# Altium schematic sheet Control.SchDoc
size A
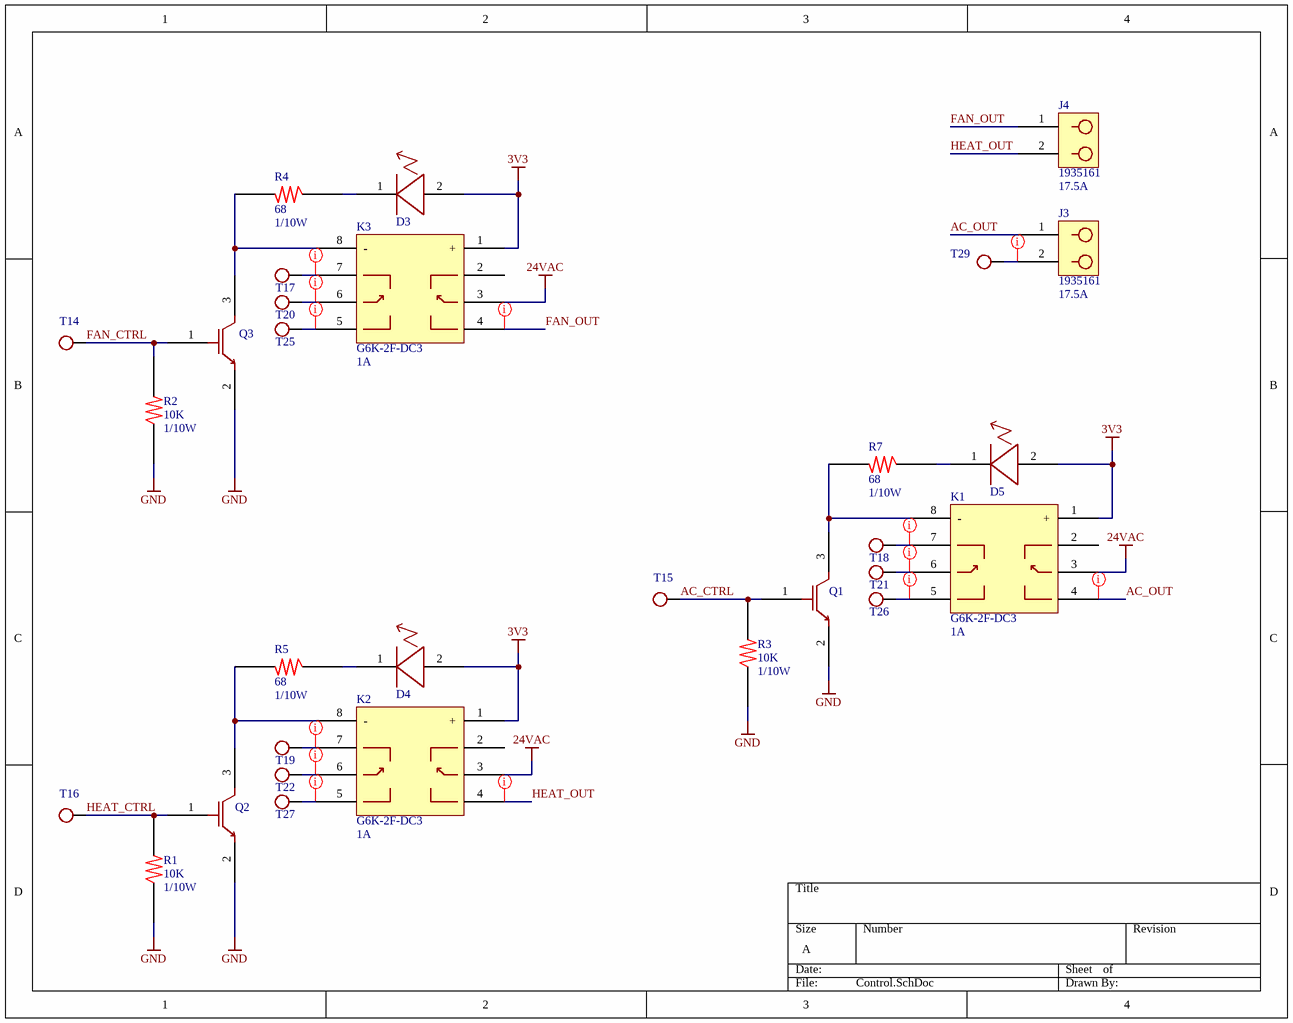
[diagram p0: Control.SchDoc]

## Parts
D3  D_LED_LED5MM  [LED5MM]  (value not drawn)
D4  D_LED_LED5MM  [LED5MM]  (value not drawn)
D5  D_LED_LED5MM  [LED5MM]  (value not drawn)
J3  Rating: 17.5A  [1935161]  (hidden comment: J_2POSTERM_1935161)
J4  Rating: 17.5A  [1935161]  (hidden comment: J_2POSTERM_1935161)
K1  Rating: 1A  PartNumber: G6K-2F-DC3  [G6K-2F]  (hidden comment: K_G6K-2F_G6K-2F)
K2  Rating: 1A  PartNumber: G6K-2F-DC3  [G6K-2F]  (hidden comment: K_G6K-2F_G6K-2F)
K3  Rating: 1A  PartNumber: G6K-2F-DC3  [G6K-2F]  (hidden comment: K_G6K-2F_G6K-2F)
Q1  Q_NFET_SOT23  [SOT23]  (value not drawn)
Q2  Q_NFET_SOT23  [SOT23]  (value not drawn)
Q3  Q_NFET_SOT23  [SOT23]  (value not drawn)
R1  value 10K  Rating: 1/10W  [0603]  (hidden comment: R_RES_0603)
R2  value 10K  Rating: 1/10W  [0603]  (hidden comment: R_RES_0603)
R3  value 10K  Rating: 1/10W  [0603]  (hidden comment: R_RES_0603)
R4  value 68  Rating: 1/10W  [0603]  (hidden comment: R_RES_0603)
R5  value 68  Rating: 1/10W  [0603]  (hidden comment: R_RES_0603)
R7  value 68  Rating: 1/10W  [0603]  (hidden comment: R_RES_0603)
T14  TESTPOINT  [TESTPOINT1MM]  (value not drawn)
T15  TESTPOINT  [TESTPOINT1MM]  (value not drawn)
T16  TESTPOINT  [TESTPOINT1MM]  (value not drawn)
T17  TESTPOINT  [TESTPOINT1MM]  (value not drawn)
T18  TESTPOINT  [TESTPOINT1MM]  (value not drawn)
T19  TESTPOINT  [TESTPOINT1MM]  (value not drawn)
T20  TESTPOINT  [TESTPOINT1MM]  (value not drawn)
T21  TESTPOINT  [TESTPOINT1MM]  (value not drawn)
T22  TESTPOINT  [TESTPOINT1MM]  (value not drawn)
T25  TESTPOINT  [TESTPOINT1MM]  (value not drawn)
T26  TESTPOINT  [TESTPOINT1MM]  (value not drawn)
T27  TESTPOINT  [TESTPOINT1MM]  (value not drawn)
T29  TESTPOINT  [TESTPOINT1MM]  (value not drawn)

## Nets
3V3: D3.2 D4.2 D5.2 K1.1(+) K2.1(+) K3.1(+)
24VAC: K1.3(S1_2) K2.3(S1_2) K3.3(S1_2)
GND: Q1.2(S) Q2.2(S) Q3.2(S) R1.1 R2.1 R3.1
AC_CTRL: Q1.1(G) R3.2 T15.1
AC_OUT: J3.1 K1.4(S1_3)
FAN_CTRL: Q3.1(G) R2.2 T14.1
FAN_OUT: J4.1 K3.4(S1_3)
HEAT_CTRL: Q2.1(G) R1.2 T16.1
HEAT_OUT: J4.2 K2.4(S1_3)
NetD3_1: D3.1 R4.1
NetD4_1: D4.1 R5.1
NetD5_1: D5.1 R7.1
NetJ3_2: J3.2 T29.1
NetK1_5: K1.5(S2_3) T26.1
NetK1_6: K1.6(S2_2) T21.1
NetK1_7: K1.7(S2_1) T18.1
NetK1_8: K1.8(-) Q1.3(D) R7.2
NetK2_5: K2.5(S2_3) T27.1
NetK2_6: K2.6(S2_2) T22.1
NetK2_7: K2.7(S2_1) T19.1
NetK2_8: K2.8(-) Q2.3(D) R5.2
NetK3_5: K3.5(S2_3) T25.1
NetK3_6: K3.6(S2_2) T20.1
NetK3_7: K3.7(S2_1) T17.1
NetK3_8: K3.8(-) Q3.3(D) R4.2

Not connected (* = marked no-connect by the designer): K1 2(S1_1); K2 2(S1_1); K3 2(S1_1)

## Layout directives
rule Clearance Constraint [Generic clearance = 25mil, and 9 value(s) for objects]; rule Width Constraint [Pref Width = 25mil    Min Width = 15mil    Max Width = 25mil]: AC_OUT, FAN_OUT, HEAT_OUT, NetJ3_2, NetK1_5, NetK1_6, NetK1_7, NetK2_5, NetK2_6, NetK2_7, NetK3_5, NetK3_6, NetK3_7

## Library data of the parts
J3 J4 = J_2POSTERM_1935161: Manufacturer: Phoenix Contact; PartNumber: 1935161
K1-K3 = K_G6K-2F_G6K-2F: Manufacturer: Omron
Q1-Q3 = Q_NFET_SOT23: Manufacturer: On Semiconductor; PartNumber: BSS138; Rating: 220mA
R1-R3 = R_RES_0603: PartNumber: RC0603JR-0710KL; Manufacturer: Yageo
R4 R5 R7 = R_RES_0603: PartNumber: RC0603FR-0768RL; Manufacturer: Yageo
T14-T22 T25-T27 T29 = T_TESTPOINT_TESTPOINT1MM: Value: 1mm